# Altium schematic sheet Button.SchDoc: LCD & BUTTON
size A4; Date: 10/04/2015; Author: MINH; DrawnBy: Minh
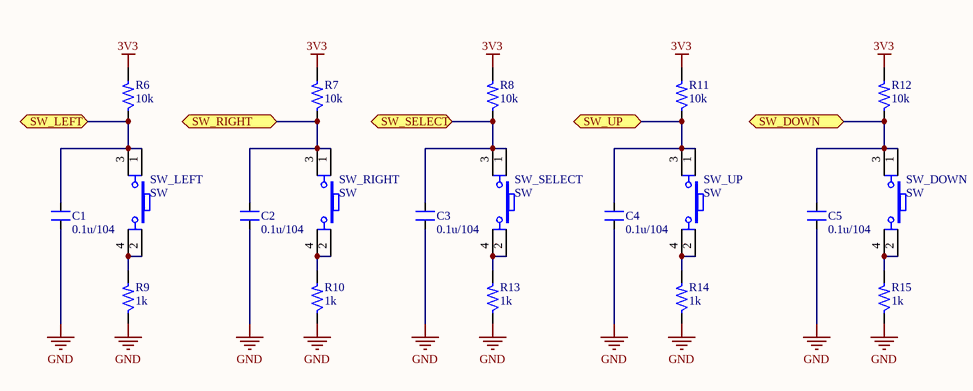
[diagram p0: Button.SchDoc]

## Parts
C1  0.1u/104  [SM-0805]
C2  0.1u/104  [SM-0805]
C3  0.1u/104  [SM-0805]
C4  0.1u/104  [SM-0805]
C5  0.1u/104  [SM-0805]
R6  10k  [SM-1206]
R7  10k  [SM-1206]
R8  10k  [SM-1206]
R9  1k  [SM-1206]
R10  1k  [SM-1206]
R11  10k  [SM-1206]
R12  10k  [SM-1206]
R13  1k  [SM-1206]
R14  1k  [SM-1206]
R15  1k  [SM-1206]
SW_DOWN  SW  [SW4]
SW_LEFT  SW  [SW4]
SW_RIGHT  SW  [SW4]
SW_SELECT  SW  [SW4]
SW_UP  SW  [SW4]

## Ports
SW_DOWN, SW_LEFT, SW_RIGHT, SW_SELECT, SW_UP

## Nets
3V3: R6.2 R7.2 R8.2 R11.2 R12.2
GND: C1.1 C2.1 C3.1 C4.1 C5.1 R9.1 R10.1 R13.1 R14.1 R15.1
SW_DOWN: C5.2 R12.1 SW_DOWN.1 SW_DOWN.3 ; port SW_DOWN
SW_LEFT: C1.2 R6.1 SW_LEFT.1 SW_LEFT.3 ; port SW_LEFT
SW_RIGHT: C2.2 R7.1 SW_RIGHT.1 SW_RIGHT.3 ; port SW_RIGHT
SW_SELECT: C3.2 R8.1 SW_SELECT.1 SW_SELECT.3 ; port SW_SELECT
SW_UP: C4.2 R11.1 SW_UP.1 SW_UP.3 ; port SW_UP
NetR9_2: R9.2 SW_LEFT.2 SW_LEFT.4
NetR10_2: R10.2 SW_RIGHT.2 SW_RIGHT.4
NetR13_2: R13.2 SW_SELECT.2 SW_SELECT.4
NetR14_2: R14.2 SW_UP.2 SW_UP.4
NetR15_2: R15.2 SW_DOWN.2 SW_DOWN.4

## Notes on the sheet
- Title
- Size:
- Date:
- A4
- Number:
- Time:
- Revision:
- Sheet
- of
- File:

## Library data of the parts
C1-C5 = CM: Cap SMD; Value: 103
R6-R15 = R: Resistor 1/4W; Value: R1/4W - 1K
SW_DOWN SW_LEFT SW_RIGHT SW_SELECT SW_UP = SW4: Switch button 4 pin; Value: Button chip 4 pin